# Altium project Antenna_base.PrjPcb
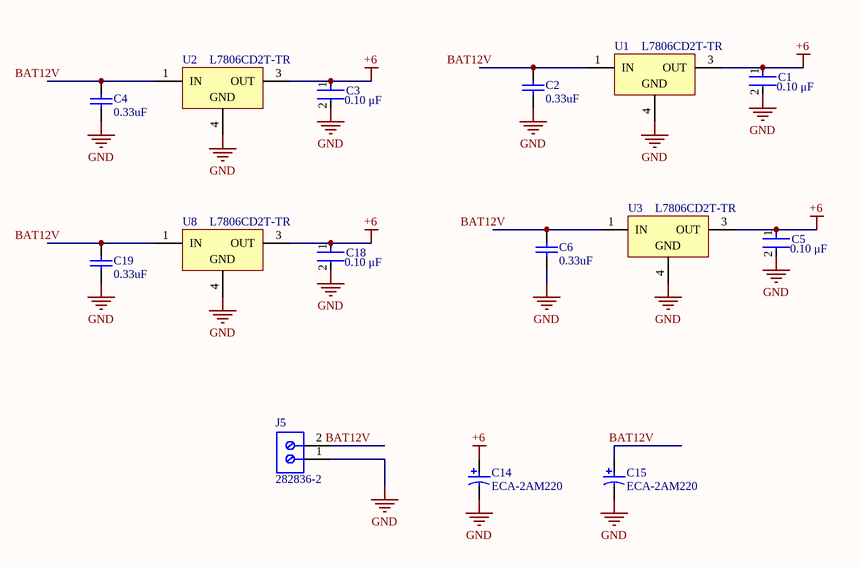
[diagram p0: 01_powersupply.SchDoc]
3 sheets, 54 parts. Net scope: global (net labels, ports and power ports of the same name join across sheets).
Board file: Antenna_base_v3.PcbDoc
Sheets:
  01_powersupply.SchDoc
  03_pushswitch.SchDoc
  05_PWMdriver.SchDoc

## Sheet 01_powersupply.SchDoc
size A

### Parts
C1  Capacitance: 0.10 μF  [FP-C0603C-CF-MFG]  (hidden comment: C0603_0.1UF)
C2  value 0.33uF  [CAPC1608X90X20LL10]  (hidden comment: C0603_0.33UF)
C3  Capacitance: 0.10 μF  [FP-C0603C-CF-MFG]  (hidden comment: C0603_0.1UF)
C4  value 0.33uF  [CAPC1608X90X20LL10]  (hidden comment: C0603_0.33UF)
C5  Capacitance: 0.10 μF  [FP-C0603C-CF-MFG]  (hidden comment: C0603_0.1UF)
C6  value 0.33uF  [CAPC1608X90X20LL10]  (hidden comment: C0603_0.33UF)
C14  ECA-2AM220  [CAPPR55-250-1120X630X1220]
C15  ECA-2AM220  [CAPPR55-250-1120X630X1220]
C18  Capacitance: 0.10 μF  [FP-C0603C-CF-MFG]  (hidden comment: C0603_0.1UF)
C19  value 0.33uF  [CAPC1608X90X20LL10]  (hidden comment: C0603_0.33UF)
J5  282836-2  [TECO-282836-2_V]
U1  L7806CD2T-TR  [TO-263_L]
U2  L7806CD2T-TR  [TO-263_L]
U3  L7806CD2T-TR  [TO-263_L]
U8  L7806CD2T-TR  [TO-263_L]

### Nets
+6: C1.1 C3.1 C5.1 C14.1 C18.1 U1.3(OUT) U2.3(OUT) U3.3(OUT) U8.3(OUT)  [project net PWM_VDD]
GND: C1.2 C2.1 C3.2 C4.1 C5.2 C6.1 C14.2 C15.2 C18.2 C19.1 J5.1 U1.4(GND) U2.4(GND) U3.4(GND) U8.4(GND)
BAT12V: C2.2 C4.2 C6.2 C15.1 C19.2 J5.2 U1.1(IN) U2.1(IN) U3.1(IN) U8.1(IN)

### Library data of the parts
C1 C3 C5 C18 = CMP-03020-016578-1: CAP CER 0.1UF 16V X7R 0603; Manufacturer Part Number: C0603C104M4RAC7411; Manufacturer: KEMET; Tolerance: 0.2; Value: 0.10 μF; Automotive Grade: Grade 1; Material: Ceramic; Temperature Coefficient: 30ppm/°C; RoHS: TRUE; Temperature: -55°C to +125°C; Automotive: Yes; Device Class L3: Ceramic Capacitors; Temperature Characteristic: X7R; Package: C0603C-CF; Digikey Description: CAP CER 0.1UF 16V X7R 0603; ComponentLink2URL: https://api.kemet.com/component-edge/download/datasheet/C0603C100J5GACAUTO.pdf; Mouser Description: Multilayer Ceramic Capacitors MLCC - SMD/SMT 16volts 0.1uF X7R 20%; Voltage Rating: 16 V; Temperature Range High: +125°C; Temperature Range Low: -55°C; Height: 0.87mm; Device Class L1: Passive Components; ComponentLink2Description: Datasheet; Lead Free: Yes; Category: Cap; Device Class L2: Capacitors; Octopart: https://octopart.com/c0603c104m4rac7411-kemet-9138805
C2 C4 C6 C19 = CMP-2000-07551-1: Chip Capacitor, 0.33 uF, +/- 10%, 50 V, -55 to 125 degC, 0603 (1608 Metric), RoHS, Tape and Reel; Manufacturer: TDK; Datasheet URL: https://product.tdk.com/info/en/catalog/datasheets/mlcc_commercial_general_en.pdf; Manufacturer URL: http://www.tdk.com/; Package Description: 2-Pin Surface Mount Device, Body 1.6 x 0.8 mm; Mounting Technology: SurfaceMount; Datasheet Version: 07/2017; Package Reference: 603
C14 C15 = CMP-1665-00035-2: Aluminum Electrolytic Capacitor, 22 uF, +/- 20%, 100 V, -40 to 85 degC, 2-Pin THD, RoHS, Bulk; Nominal Vf: 2.1 V; Luminous Intensity: 2 mcd; Viewing Angle: 130 degrees; Lens Style: Clear; Colour: Orange; Forward Current: 20 mA; Case\Package: 0603; ComponentLink2URL: https://industrial.panasonic.com/cdbs/www-data/pdf/RDF0000/ABA0000C1047.pdf; Height: 1.1 mm; Max Operating Temperature: 85 degC; Width: 0.8 mm; ComponentLink1Description: Manufacturer URL; Min Operating Temperature: -55 degC; Package Quantity: 3000; RoHSCompliant: true; DatasheetVersion: Mar-16; Length: 1.6 mm; ComponentLink1URL: http://www.panasonic.com/; Packaging: Tape and Reel; Case Code (Imperial): 0603; Radiation Hardening: No; ComponentLink2Description: Datasheet; Mount: Surface Mount; PackageDescription: 2-Pin Through Hole Device, Dia 6.3 mm, Body Length 11.2 mm; Pins: 2; PackageReference: Radial; Illumination Colour: Orange; Case Code (Metric): 1608; Forward Voltage: 2.1 V
J5 = CMP-1684-00017-1: Female Header, Pitch 5 mm, 1 x 2 Position, Height 10 mm, Tail Length 3.5 mm, Rohs, Bulk; Manufacturer: TE Connectivity; Wire Gauge: 16-30AWG; Product Training Modules: Wire-to-BoardEurostyleTerminalBlocks; Clamp Material - Plating: Brass-NickelPlated; Voltage: 300V; Mating Orientation: HorizontalwithBoard; Current: 13.5A; Pitch: 0.197"(5.00mm); Screw Thread: M3; 3D Model: 282836-2.pdf; Other Names: 5ULV-02B / A98076; Dynamic Catalog: BuchananSeries; Number of Levels: 1; Torque - Screw: 0.68Nm(6Lb-In); Featured Product: EurostyleTerminalBlockConnectors; Positions Per Level: 2; Wire Termination: Screw-RisingCageClamp; Datasheet URL: http://www.te.com.cn/commerce/DocumentDelivery/DDEController?Action=showdoc&DocId=Catalog+Section%7F1308389_EUROSTYLE_TERMINAL_BLOCKS%7F0607%7Fpdf%7FEnglish%7FENG_CS_1308389_EUROSTYLE_TERMINAL_BLOCKS_0607.pdf%7F282836-2; Color: Green; Family: TerminalBlocks-WiretoBoard; RoHS Information: 282836-2StatementofCompliance; Standard Package: 300; Contact Material - Plating: Brass-TinPlated; Manufacturer URL: http://www.te.com; Housing Material: Polyamide(PA66),Nylon6/6; Features: Interlocking(Side); Package Description: Female Header, Pitch 5 mm, 1 x 2 Position, Height 10 mm, Tail Length 3.5 mm; Mounting Type: ThroughHole; Package Reference: THD; Packaging: Bulk; Series: Buchanan; Category: Connectors,Interconnects; Screw Material - Plating: Brass-NickelPlated
U1-U3 U8 = CMP-0244-00208-1: Positive Voltage Regulator, 3-Pin D2PAK, Tape and Reel; PackageDescription: 3-Pin Transistor Outline Package 2.54 mm Pitch, 15.4 mm Lead Span (D2PAK); ComponentLink1Description: Manufacturer URL; ComponentLink2URL: http://www.st.com/internet/com/TECHNICAL_RESOURCES/TECHNICAL_LITERATURE/DATASHEET/CD00000444.pdf; ComponentLink1URL: http://www.st.com; ComponentLink2Description: Datasheet; DatasheetVersion: 16/11/2011; PackageReference: TO-263; PackageVersion: 2011

## Sheet 03_pushswitch.SchDoc
size A
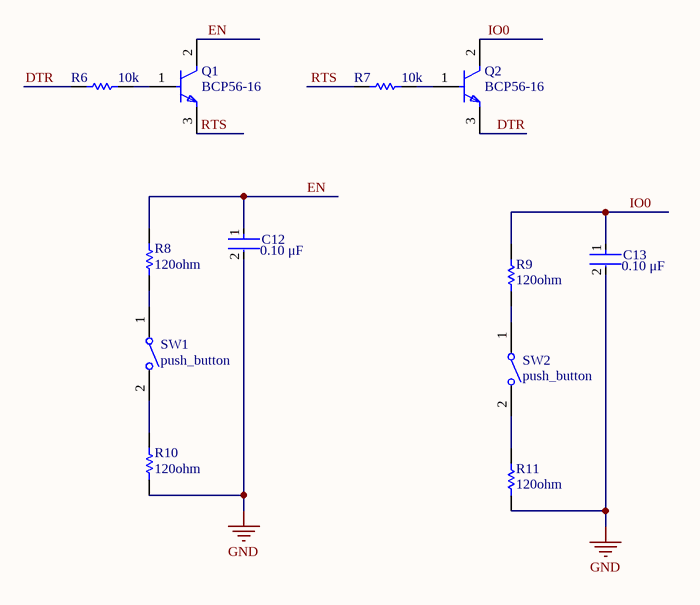
[diagram p1: 03_pushswitch.SchDoc]

### Parts
C12  Capacitance: 0.10 μF  [FP-C0603C-CF-MFG]  (hidden comment: C0603_0.1UF)
C13  Capacitance: 0.10 μF  [FP-C0603C-CF-MFG]  (hidden comment: C0603_0.1UF)
Q1  BCP56-16  [FP-SOT-223-P008-MFG]
Q2  BCP56-16  [FP-SOT-223-P008-MFG]
R6  value 10k  [RESC1609X55X30LL15T15]  (hidden comment: R0603_10K)
R7  value 10k  [RESC1609X55X30LL15T15]  (hidden comment: R0603_10K)
R8  value 120ohm  [RESC1608X55X30NL20T20]  (hidden comment: R0603_120R)
R9  value 120ohm  [RESC1608X55X30NL20T20]  (hidden comment: R0603_120R)
R10  value 120ohm  [RESC1608X55X30NL20T20]  (hidden comment: R0603_120R)
R11  value 120ohm  [RESC1608X55X30NL20T20]  (hidden comment: R0603_120R)
SW1  push_button  [TECO-FSMSMTR_V]
SW2  push_button  [TECO-FSMSMTR_V]

### Nets
GND: C12.2 C13.2 R10.1 R11.1
DTR: Q2.3(E) R6.1
EN: C12.1 Q1.2(C) R8.2
IO0: C13.1 Q2.2(C) R9.2
RTS: Q1.3(E) R7.1
NetQ1_1: Q1.1(B) R6.2
NetQ2_1: Q2.1(B) R7.2
NetR8_1: R8.1 SW1.1
NetR9_1: R9.1 SW2.1
NetR10_2: R10.2 SW1.2
NetR11_2: R11.2 SW2.2

### Library data of the parts
C12 C13 = CMP-03020-016578-1: as C1 on sheet 01_powersupply; RoHS: TRUE; Temperature: -55°C to +125°C; Automotive: Yes; Device Class L3: Ceramic Capacitors; Temperature Characteristic: X7R; Package: C0603C-CF; Digikey Description: CAP CER 0.1UF 16V X7R 0603; ComponentLink2URL: https://api.kemet.com/component-edge/download/datasheet/C0603C100J5GACAUTO.pdf; Mouser Description: Multilayer Ceramic Capacitors MLCC - SMD/SMT 16volts 0.1uF X7R 20%; Voltage Rating: 16 V; Temperature Range High: +125°C; Temperature Range Low: -55°C; Height: 0.87mm; Device Class L1: Passive Components; ComponentLink2Description: Datasheet; Lead Free: Yes; Category: Cap; Device Class L2: Capacitors; Octopart: https://octopart.com/c0603c104m4rac7411-kemet-9138805
Q1 Q2 = CMP-12195-000003-1: TRANS NPN 80V 1A SOT-223; Manufacturer: STMicroelectronics; Number Of Npn: 1; Hfe Max: 250; Hfe Min: 100; Power Dissipation: 1.6W; Collector Base Voltage: 100V; Emitter Base Voltage: 5V; Max Junction Temp: +150°C; Rthja Max: 78°C/W; Standoff Height: 0.02mm; Collector Emitter Saturation Voltage: 0.5V; Hfe Testvce: 2V; Hfe Testic: 150mA; Package: SOT-223-P008; Octopart: https://octopart.com/bcp56-16-stmicroelectronics-13883839; Digikey Description: TRANS NPN 80V 1A SOT-223; RoHS: TRUE; Device Class L1: Discrete Semiconductors; Manufacturer Part Number: BCP56-16; Collector Emitter Voltage: 80V; Mouser Description: BCP56 Series 80 V 1 A 1.6 W Surface Mount Low Power NPN Transistor - SOT-223; Collector Emitter Breakdown Voltage: 80V; Category: Trans; Automotive: No; Ipc Land Pattern Name: SOT230P700X180-4; Temperature: to +150°C; Number Of Elements: 1; Footprint Url: https://www.st.com/content/ccc/resource/technical/document/application_note/45/cc/69/ea/2f/8d/4e/3c/CD00004438.pdf/files/CD00004438.pdf/jcr:content/translations/en.CD00004438.pdf; ComponentLink2URL: https://www.st.com/resource/en/datasheet/bcp56-16.pdf; Device Class L2: Transistors; Temperature Range High: +150°C; Device Class L3: BJTs; Height: 1.82mm; ComponentLink2Description: Datasheet; Lead Free: Yes; Max Collector Current: 1A
R6 R7 = CMP-2000-07452-1: Chip Resistor, 10 KOhm, +/- 1%, 0.1 W, -55 to 155 degC, 0603 (1608 Metric), RoHS, Tape and Reel; Manufacturer: Panasonic; Voltage Rating: 75V; Case\/Package: 0603; Power Rating: 100mW; Resistance: 10KOhm; Temperature Coefficient: 100ppm\/degreesC; Number of Pins: 2; Package Reference: 603; Depth: 0.8mm; Mount: SurfaceMount; Package Description: 2-Pin Surface Mount Device, Body 1.6 x 0.85 mm; Datasheet Version: 02/2017; Length: 1.6mm; Lead Free: LeadFree; Height: 0.45mm; Number of Terminations: 2; Max Power Dissipation: 100mW; Min Operating Temperature: -55degC; Datasheet URL: https://industrial.panasonic.com/cdbs/www-data/pdf/RDA0000/AOA0000C304.pdf; Termination: SMD/SMT; Case Code (Metric): 1608; Case Code (Imperial): 0603; Tolerance: 1%; Max Operating Temperature: 155degC; RoHSCompliant: true; Voltage Rating (DC): 75V; Radiation Hardening: No; Packaging: TapeandReel; Composition: ThickFilm; Mounting Technology: SurfaceMount; Manufacturer URL: http://www.panasonic.com/; Width: 0.031inch; REACH SVHC: NoSVHC; Contact Plating: Tin; Military Standard: Not; Package Quantity: 1
R8-R11 = CMP-2000-00896-1: Part Number: ERA-3AEB121V; Manufacturer: Panasonic
SW1 SW2 = CMP-2000-07501-1: FSMSM Push Button Switch, 50 mA, -35 to 85 degC, 2-Pin SMD, RoHS, Tape and Reel; Manufacturer: TE Connectivity; Voltage Rating (DC): 24V; Electrical Life: 20000Cycles; Operating Force: 180gf; Switch Travel: 0.25mm; Contact Current Rating: 50mA; Case\/Package: SMD/SMT; Actuator Length: 1.07mm; Throw Configuration: SPST; Actuator Material: Polyamide; Contact Resistance: 100mOhm; Illumination Type: Illuminated; Max Voltage Rating (DC): 12V; Manufacturer URL: http://www.te.com/; Lead Free: LeadFree; Packaging: TapeandReel; Min Operating Temperature: -35degC; Mechanical Life: 20000Cycles; Mount: SurfaceMount; REACH SVHC: Unknown; Package Quantity: 1800; Package Reference: FSMSMTR; RoHSCompliant: true; Max Operating Temperature: 85degC; Orientation: Straight; ELV: Compliant; Datasheet URL: http://www.te.com/commerce/DocumentDelivery/DDEController?Action=showdoc&DocId=Customer+Drawing%7F1437566-3%7FC2%7Fpdf%7FEnglish%7FENG_CD_1437566-3_C2_1437566_3_1_c.dwg.pdf%7F1437566-4; Package Description: 2-Pin Surface Mount Device, Body 6 x 3.5 mm, Pitch 9.19 mm; Current Rating: 50mA; Contact Plating: Silver; Termination: GullWing; Datasheet Version: Rev. C2, 08/2014; Contact Material: Brass; Mounting Technology: SurfaceMount

## Sheet 05_PWMdriver.SchDoc
size A
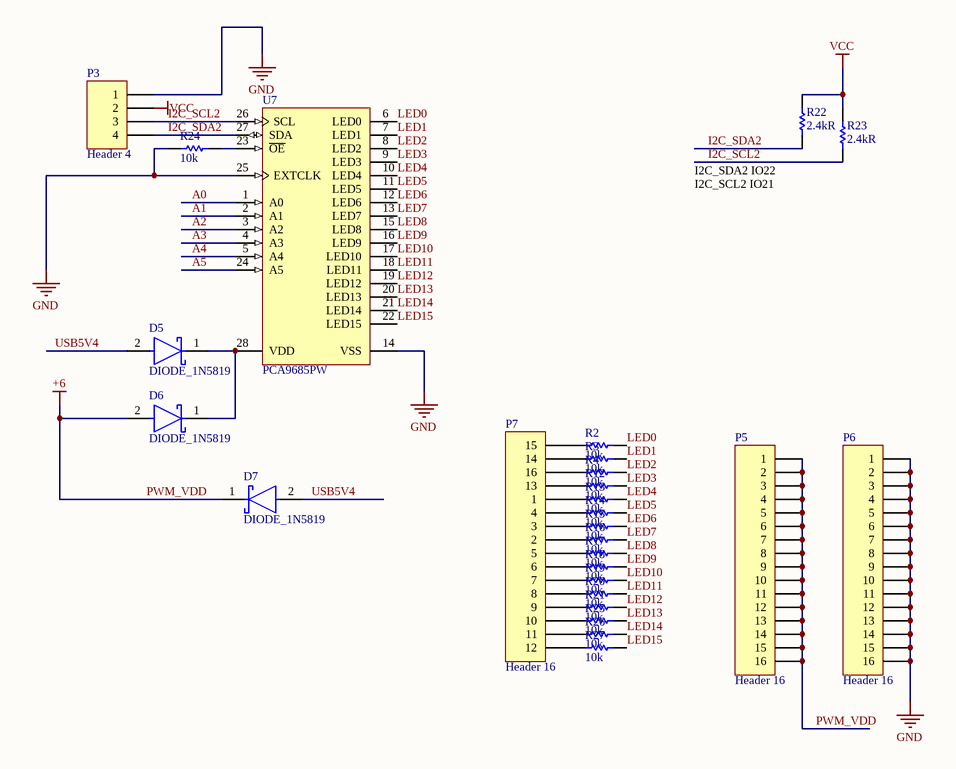
[diagram p2: 05_PWMdriver.SchDoc]

### Parts
D5  DIODE_1N5819  [FP-SOD123-MFG]
D6  DIODE_1N5819  [FP-SOD123-MFG]
D7  DIODE_1N5819  [FP-SOD123-MFG]
P3  Header 4  [HDR1X4]
P5  Header 16  [HDR1X16]
P6  Header 16  [HDR1X16]
P7  Header 16  [HDR1X16]
R2  value 10k  [RESC1609X55X30LL15T15]  (hidden comment: R0603_10K)
R3  value 10k  [RESC1609X55X30LL15T15]  (hidden comment: R0603_10K)
R4  value 10k  [RESC1609X55X30LL15T15]  (hidden comment: R0603_10K)
R12  value 10k  [RESC1609X55X30LL15T15]  (hidden comment: R0603_10K)
R13  value 10k  [RESC1609X55X30LL15T15]  (hidden comment: R0603_10K)
R14  value 10k  [RESC1609X55X30LL15T15]  (hidden comment: R0603_10K)
R15  value 10k  [RESC1609X55X30LL15T15]  (hidden comment: R0603_10K)
R16  value 10k  [RESC1609X55X30LL15T15]  (hidden comment: R0603_10K)
R17  value 10k  [RESC1609X55X30LL15T15]  (hidden comment: R0603_10K)
R18  value 10k  [RESC1609X55X30LL15T15]  (hidden comment: R0603_10K)
R19  value 10k  [RESC1609X55X30LL15T15]  (hidden comment: R0603_10K)
R20  value 10k  [RESC1609X55X30LL15T15]  (hidden comment: R0603_10K)
R21  value 10k  [RESC1609X55X30LL15T15]  (hidden comment: R0603_10K)
R22  value 2.4kR  [RESC1608X50X30ML20T20]  (hidden comment: R0603_2.4K)
R23  value 2.4kR  [RESC1608X50X30ML20T20]  (hidden comment: R0603_2.4K)
R24  value 10k  [RESC1609X55X30LL15T15]  (hidden comment: R0603_10K)
R25  value 10k  [RESC1609X55X30LL15T15]  (hidden comment: R0603_10K)
R26  value 10k  [RESC1609X55X30LL15T15]  (hidden comment: R0603_10K)
R27  value 10k  [RESC1609X55X30LL15T15]  (hidden comment: R0603_10K)
U7  PCA9685PW  [SOT361-1_V]

### Nets
GND: P3.1 P6.1 P6.2 P6.3 P6.4 P6.5 P6.6 P6.7 P6.8 P6.9 P6.10 P6.11 P6.12 P6.13 P6.14 P6.15 P6.16 R24.2 U7.14(VSS) U7.25(EXTCLK)
PWM_VDD: D6.2(A) D7.1(C) P5.1 P5.2 P5.3 P5.4 P5.5 P5.6 P5.7 P5.8 P5.9 P5.10 P5.11 P5.12 P5.13 P5.14 P5.15 P5.16  [also labelled +6]
VCC: P3.2 R22.2 R23.2
A0: U7.1(A0)
A1: U7.2(A1)
A2: U7.3(A2)
A3: U7.4(A3)
A4: U7.5(A4)
A5: U7.24(A5)
I2C_SCL2: P3.3 R23.1 U7.26(SCL)
I2C_SDA2: P3.4 R22.1 U7.27(SDA)
LED0: R2.1 U7.6(LED0)
LED1: R3.1 U7.7(LED1)
LED2: R4.1 U7.8(LED2)
LED3: R12.1 U7.9(LED3)
LED4: R13.1 U7.10(LED4)
LED5: R14.1 U7.11(LED5)
LED6: R15.1 U7.12(LED6)
LED7: R16.1 U7.13(LED7)
LED8: R17.1 U7.15(LED8)
LED9: R18.1 U7.16(LED9)
LED10: R19.1 U7.17(LED10)
LED11: R20.1 U7.18(LED11)
LED12: R21.1 U7.19(LED12)
LED13: R25.1 U7.20(LED13)
LED14: R26.1 U7.21(LED14)
LED15: R27.1 U7.22(LED15)
USB5V4: D5.2(A) D7.2(A)
NetD5_1: D5.1(C) D6.1(C) U7.28(VDD)
NetP7_1: P7.1 R13.2
NetP7_2: P7.2 R16.2
NetP7_3: P7.3 R15.2
NetP7_4: P7.4 R14.2
NetP7_5: P7.5 R17.2
NetP7_6: P7.6 R18.2
NetP7_7: P7.7 R19.2
NetP7_8: P7.8 R20.2
NetP7_9: P7.9 R21.2
NetP7_10: P7.10 R25.2
NetP7_11: P7.11 R26.2
NetP7_12: P7.12 R27.2
NetP7_13: P7.13 R12.2
NetP7_14: P7.14 R3.2
NetP7_15: P7.15 R2.2
NetP7_16: P7.16 R4.2
NetR24_1: R24.1 U7.23(~{OE})

### Notes on the sheet
- I2C_SDA2 IO22
  I2C_SCL2 IO21

### Library data of the parts
D5-D7 = CMP-12790-000018-1: DIODE SCHOTTKY 40V 1A SOD123; Manufacturer: Diodes Inc; Manufacturer Part Number: 1N5819HW-7-F; Max Surge Forward Current: 25A; Peak Reverse Current: 1mA; Max Junction Temp: +125°C; Import Ts: 1521843113; Vr V: 40; Standoff Height: 0mm; Capacitance: 50pF; Value: 50pF; Ciiva Ids: 815630; If A: 1; Automotive: No; Device Class L1: Discrete Semiconductors; Octopart: https://octopart.com/1n5819hw-7-f-diodes+inc.-323197; Terminal Temperature Tt Degc: 90; ComponentLink2Description: Datasheet; Temperature Range High: +125°C; Package: SOD123; Reverse Voltage: 40V; Temperature Range Low: -65°C; Mouser Description: 1N5819HW Series 40 V 1 A Surface Mount Schottky Barrier Rectifier - SOD-123; Device Class L2: Diodes; Lead Free: Yes; Max Repetitive Reverse Voltage: 40V; Ipc Land Pattern Name: SOD365155X123-2; Forward Current: 1A; Device Class L3: Schottky Diodes; Digikey Description: DIODE SCHOTTKY 40V 1A SOD123; ComponentLink2URL: https://www.diodes.com/assets/Datasheets/ds30217.pdf; Footprint Url: https://www.diodes.com/assets/Package-Files/SOD123.pdf; RoHS: TRUE; Category: Diode; Height: 1.45mm; Release Date: 1385348939; Temperature: -65°C to +125°C
P3 = Header 4: Header, 4-Pin; LatestRevisionDate: 17-Jul-2002; LatestRevisionNote: Re-released for DXP Platform.; Publisher: Altium Limited
P5-P7 = Header 16: Header, 16-Pin; LatestRevisionDate: 17-Jul-2002; LatestRevisionNote: Re-released for DXP Platform.; Publisher: Altium Limited
R2-R4 R12-R21 R24-R27 = CMP-2000-07452-1: as R6 on sheet 03_pushswitch; Number of Pins: 2; Package Reference: 603; Depth: 0.8mm; Mount: SurfaceMount; Package Description: 2-Pin Surface Mount Device, Body 1.6 x 0.85 mm; Datasheet Version: 02/2017; Length: 1.6mm; Lead Free: LeadFree; Height: 0.45mm; Number of Terminations: 2; Max Power Dissipation: 100mW; Min Operating Temperature: -55degC; Datasheet URL: https://industrial.panasonic.com/cdbs/www-data/pdf/RDA0000/AOA0000C304.pdf; Termination: SMD/SMT; Case Code (Metric): 1608; Case Code (Imperial): 0603; Tolerance: 1%; Max Operating Temperature: 155degC; RoHSCompliant: true; Voltage Rating (DC): 75V; Radiation Hardening: No; Packaging: TapeandReel; Composition: ThickFilm; Mounting Technology: SurfaceMount; Manufacturer URL: http://www.panasonic.com/; Width: 0.031inch; REACH SVHC: NoSVHC; Contact Plating: Tin; Military Standard: Not; Package Quantity: 1
R22 R23 = CMP-2000-02561-1: Part Number: RR0816P-242-D; Manufacturer: Susumu
U7 = CMP-1595-00004-2: 16-Channel, 12-Bit PWM Fm+ I2C-Bus LED Controller, 2.3 to 5.5 V, -40 to 85 degC, 28-Pin TSSOP (SOT361-1), RoHS, Tape and Reel; Supply Current Max: 10 mA; Supply Voltage Min: 2.3 V; Supply Voltage Max: 5.5 V; Frequency: 25000000 Hz; Temperature Min: -40 degC; PackageDescription: 28-Pin Small Outline Package, Body 9.7 x 4.4 mm, Pitch 0.65 mm; RoHS: TRUE; ComponentLink1Description: Manufacturer URL; Code_JEDEC: MO-153; PartNumber: PCA9685; ComponentLink2URL: http://www.nxp.com/documents/data_sheet/PCA9685.pdf; Packing: Tape and Reel; ComponentLink1URL: http://www.nxp.com/; ComponentLink3Description: Package Specification; ComponentLink2Description: Datasheet; ComponentLink3URL: http://www.nxp.com/documents/outline_drawing/sot361-1_po.pdf; DatasheetVersion: Rev. 4; Temperature Max: 85 degC; PackageVersion: 02/2003; Mounting Technology: Surface Mount

## Nets that join several sheets
GND: 01_powersupply (15 pins), 03_pushswitch (C12.2 C13.2 R10.1 R11.1), 05_PWMdriver (20 pins)
PWM_VDD: 01_powersupply (9 pins), 05_PWMdriver (18 pins)